# EAGLE design mkrd-001 (EAGLE 9.6.2)
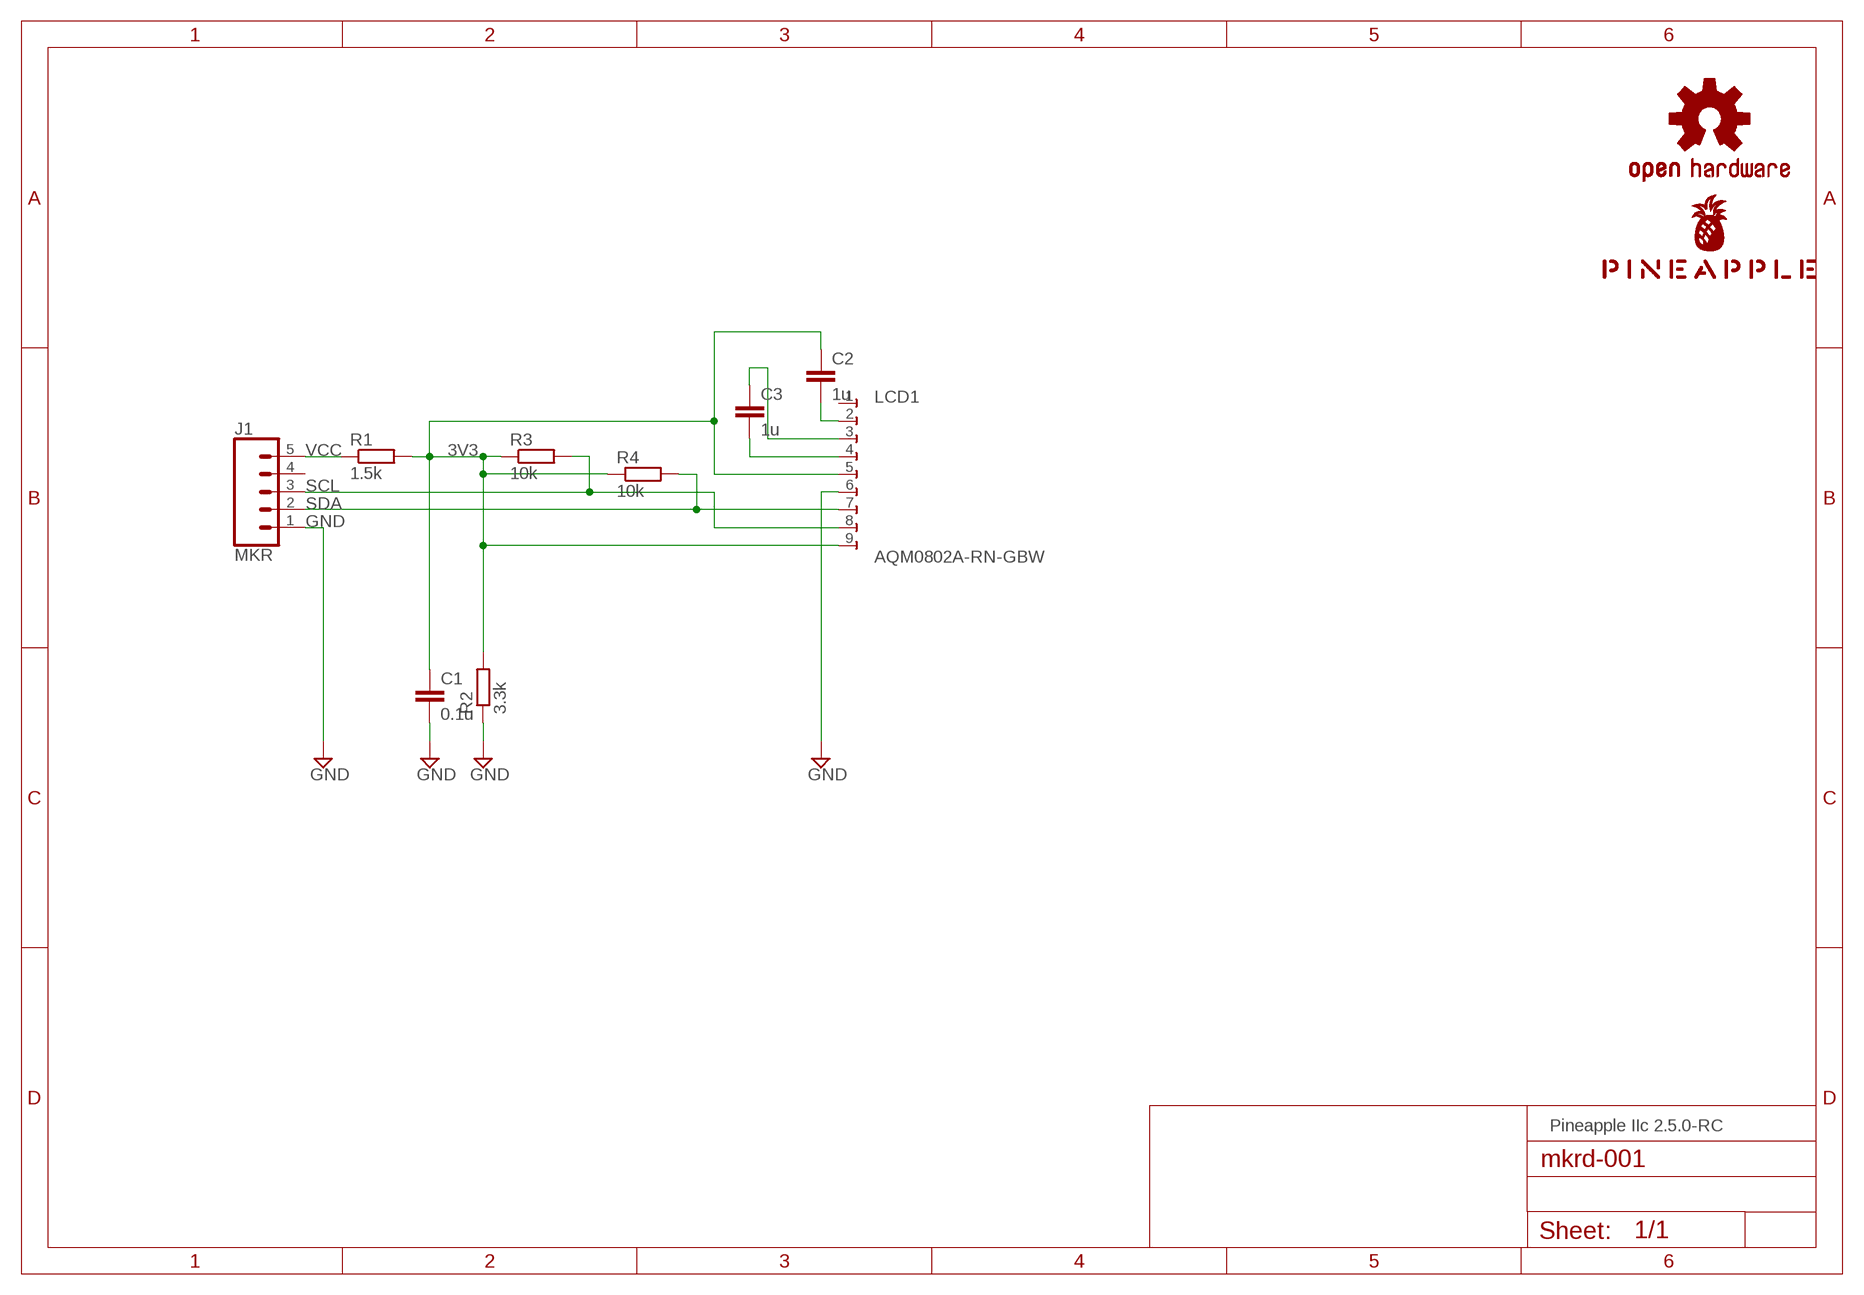
[diagram p0: schematic, sheet 1]

## Parts
C1  0.1u  C-EU025-024X044  [C025-024X044]
C2  1u  C-EU025-025X050  [C025-025X050]
C3  1u  C-EU025-025X050  [C025-025X050]
J1  MKR  CONN_05JST  [JST-5-PTH]
LCD1  AQM0802A-RN-GBW  [AQM0802A-RN-GBW-FOOTPRINT]
LOGO1  OSHW-LOGOS-COPPER  [OSHW-LOGO-S_COPPER]
R1  1.5k  R-EU_0204/5  [0204/5]
R2  3.3k  R-EU_0204/5  [0204/5]
R3  10k  R-EU_0204/5  [0204/5]
R4  10k  R-EU_0204/5  [0204/5]
U$1  PINEAPPLE450_SILK  [PINEAPPLE450_SILK]

## Nets
3V3: C1.1 C2.1 LCD1.5 LCD1.9 R1.2 R2.2 R3.1 R4.1
CAP1N: C3.1 LCD1.3
CAP1P: C3.2 LCD1.4
GND: C1.2 J1.1 LCD1.6 R2.1
LCDVOUT: C2.2 LCD1.2
SCL: J1.3 LCD1.8 R3.2
SDA: J1.2 LCD1.7 R4.2
VCC: J1.5 R1.1
Unconnected: J1.4 LCD1.1

## Notes on the sheet
- Pineapple IIc 2.5.0-RC

## Library data of the parts
C1-C3 = rcl:C-EU: CAPACITOR, European symbol; SPICEPREFIX: C
J1 = SparkFun-Connectors:CONN_05: Multi connection point. Often used as Generic Header-pin footprint for 0.1 inch spaced/style header connections On any of the 0.1 inch spaced packages, you can populate with these: Break Away Headers - Straight <https://www.sparkfun.com/products/116> (PRT-00116) Break Away Male Headers - Right Angle <https://www.sparkfun.com/products/553> (PRT-00553) Female Headers <https://www.sparkfun.com/products/115> (PRT-00115) Break Away Headers - Machine Pin <https://www.sparkfun.com/products/117> (PRT-00117) Break Away Female Headers - Swiss Machine Pin <https://www.sparkfun.com/products/743> (PRT-00743) For SCREWTERMINALS and SPRING TERMINALS visit here: Screw Terimnals on SparkFun.com <https://www.sparkfun.com/search/results?term=Screw+Terminals> (5mm/3.5mm/2.54mm spacing) This device is also useful as a general connection point to wire up your design to another part of your project. Our various solder wires solder well into these plated through hole pads. Hook-Up Wire - Assortment (Stranded, 22 AWG) <https://www.sparkfun.com/products/11375> (PRT-11375) Hook-Up Wire - Assortment (Solid Core, 22 AWG) <https://www.sparkfun.com/products/11367> (PRT-11367) View the entire wire category on our website here <https://www.sparkfun.com/categories/141> Special notes: Molex polarized connector foot print use with SKU : PRT-08231 with associated crimp pins and housings. 1MM SMD Version SKU: PRT-10208; SF_ID: PRT-09917
LCD1 = AQM0802A-RN-GBW:AQM0802A-RN-GBW: AQM0802A-RN-GBW LCD
LOGO1 = SparkFun-Aesthetics:OSHW-LOGO: Open-Source Hardware (OSHW) Logo This logo indicates the piece of hardware it is found on incorporates a OSHW license and/or adheres to the definition of open source hardware found here: http://freedomdefined.org/OSHW
R1-R4 = rcl:R-EU_: RESISTOR, European symbol; SPICEPREFIX: R
U$1 = pineapple:PINEAPPLE450_SILK

## Net classes
0 default: width 0.152 mm, drill 0.152 mm, clearance 0.152 mm
1 ground: width 0.305 mm, drill 0.152 mm, clearance 0.152 mm
2 power1: width 0.508 mm, drill 0.152 mm, clearance 0.152 mm
3 power2: width 0.61 mm, drill 0.152 mm, clearance 0.152 mm
4 analog: width 0.305 mm, drill 0.152 mm, clearance 0.152 mm
5 external: width 0.152 mm, drill 0.152 mm, clearance 0.152 mm

## Board
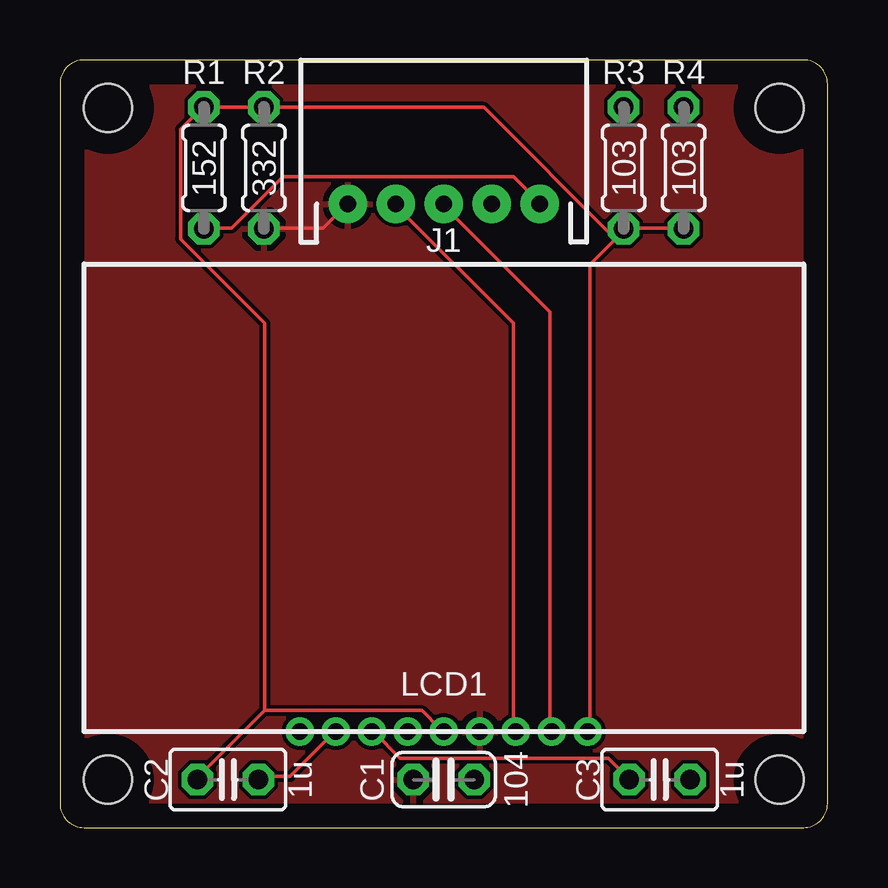
[diagram p1: board, top side]
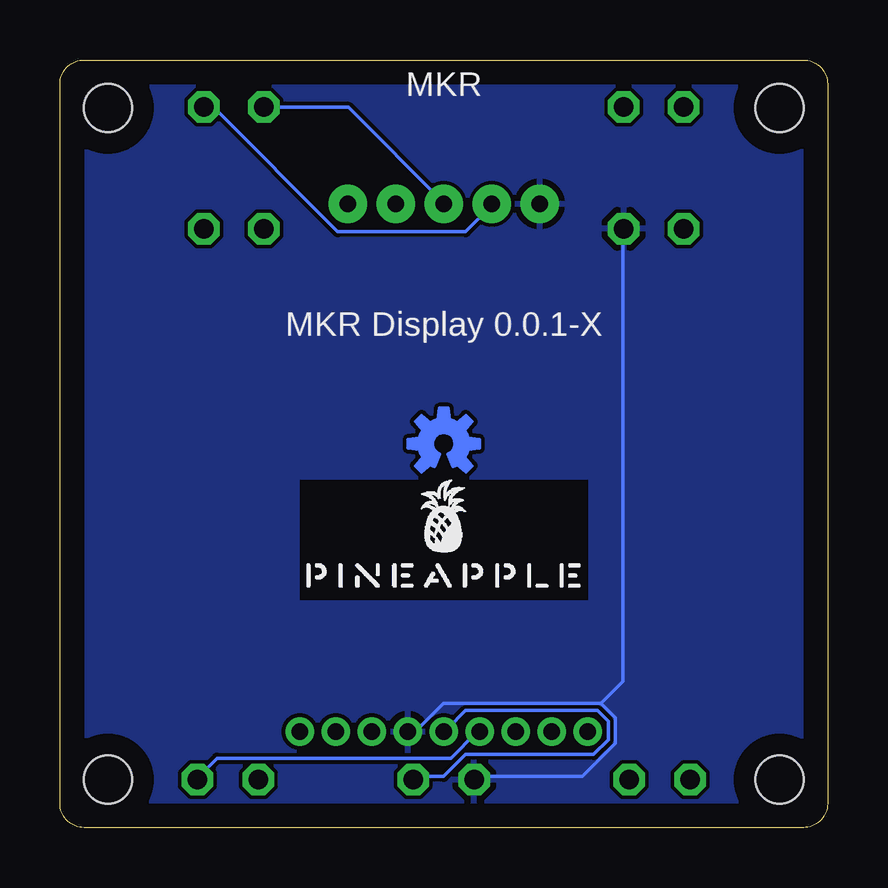
[diagram p2: board, bottom side, seen from below]

Size 32 x 32 mm. Coordinates in mm from the lower left corner, seen from the top.
Outline: 0,31 0,1 arc90 1,0 31,0 arc90 32,1 32,31 arc90 31,32 1,32 arc90 0,31
Copper layers (1*16): Top 0.035mm / dielectric 1.5mm / Bottom 0.035mm
Design rules "SeeedStudio_2layer_DRU_no_angle_20140221": minimum track width 6mil, minimum drill 12mil, track to track 6mil, track to pad 6mil, pad to pad 6mil, via to via 6mil, smd to smd 0mil, copper to edge 10mil, drill to drill 10mil, minimum pad ring 10mil, minimum via ring 6mil, stop-mask expansion 2mil, vias tented up to drill 100mil, thermal gap 10mil
Holes 2 mm at 2,2 30,2 30,30 2,30
tRestrict: area 0.2,0.2 to 3.8,3.8; area 0,0 to 1,32; area 0,31 to 32,32; area 31,0 to 32,32; area 0,0 to 32,1; area 0.2,28.2 to 3.8,31.8; area 28.2,28.2 to 31.8,31.8; area 28.2,0.2 to 31.8,3.8
bRestrict: area 0,0 to 32,1; area 31,0 to 32,32; area 0,31 to 32,32; area 0,0 to 1,32; area 28.2,0.2 to 31.8,3.8; area 0.2,28.2 to 3.8,31.8; area 0.2,0.2 to 3.8,3.8; area 28.2,28.2 to 31.8,31.8; area 10,9.5 to 22,14.5

### Footprints (pad centres in the part's own frame; a part is rotated, then mirrored left to right if it is on the bottom)
C025-024X044 = drill 0.813 octagon: 1 -1.27,0; 2 1.27,0
C025-025X050 = drill 0.813 octagon: 1 -1.27,0; 2 1.27,0
JST-5-PTH = drill 0.7 pad 1.6: 1 -4,0; 2 -2,0; 3 0,0; 4 2,0; 5 4,0
AQM0802A-RN-GBW-FOOTPRINT = drill 0.7 pad 1: 1 -6,0; 2 -4.5,0; 3 -3,0; 4 -1.5,0; 5 0,0; 6 1.5,0; 7 3,0; 8 4.5,0; 9 6,0
0204/5 = drill 0.813 octagon: 1 -2.54,0; 2 2.54,0

### Placement (x,y rotation side)
C1  16,2 180 top
C2  7,2 0 top
C3  25,2 0 top
J1  16,26 0 top
LCD1  16,4 0 top
LOGO1  16,16 0 bottom
R1  6,27.5 90 top
R2  8.5,27.5 90 top
R3  23.5,27.5 90 top
R4  26,27.5 90 top
U$1  16,10 0 bottom

### Tracks (layer width: path | path; a pad name or v marks a point on that pad's centre or on a via)
3V3
  Top 0.152: 8.53,4.88 15.09,4.88 15.85,4.12 LCD1.5 | 8.53,4.88 5.79,2.13 C2.1 | 23.16,24.54 23.47,24.84 R3.1 | 23.16,24.54 22.1,23.47 22.1,4.12 LCD1.9 | R4.1 25.91,24.99 23.62,24.99 R3.1 | 23.16,24.54 17.68,30.02 8.53,30.02 R2.2 8.38,30.02 6.1,30.02 R1.2 5.94,30.02 5.03,29.11 5.03,24.54 8.53,21.03 8.53,4.88 | 23.16,24.54 R3.1
  Bottom 0.152: C1.1 17.22,2.13 16,2.13 15.09,3.05 9.75,3.05 9.14,3.66 9.14,4.42 9.6,4.88 15.09,4.88 15.85,4.12 LCD1.5
CAP1N
  Top 0.152: LCD1.3 13.11,3.96 14.17,2.9 22.86,2.9 23.62,2.13 C3.1
CAP1P
  Bottom 0.152: LCD1.4 14.63,3.96 15.7,2.9 25.45,2.9 26.21,2.13 C3.2
GND
  Top 0.152: R2.1 8.53,24.99 10.97,24.99 11.89,25.91 J1.1
  Bottom 0.152: 9.45,5.18 16,5.18 17.07,4.12 17.37,4.12 LCD1.6 | 9.45,5.18 8.84,4.57 8.84,3.5 10.21,2.13 14.63,2.13 C1.2 | 9.45,5.18 8.53,6.1 8.53,24.84 R2.1
  pour Top: -1,-1 33,-1 33,33 -1,33
  pour Bottom: -2,-2 34,-2 34,34 -2,34
LCDVOUT
  Top 0.152: LCD1.2 11.43,3.96 9.6,2.13 8.38,2.13 C2.2
SCL
  Top 0.152: LCD1.8 20.42,4.12 20.42,21.49 16,25.91 J1.3
  Bottom 0.152: R3.2 23.47,30.02 19.96,30.02 16,26.06 J1.3
SDA
  Top 0.152: LCD1.7 18.9,4.12 18.9,21.03 14.02,25.91 J1.2
  Bottom 0.152: R4.2 25.91,30.02 25.6,30.02 20.42,24.84 15.09,24.84 14.02,25.91 J1.2
VCC
  Top 0.152: R1.1 6.1,24.99 7.16,24.99 9.3,27.13 18.9,27.13 19.96,26.06 J1.5

### Text on the board
tNames: 152 | 332 | 103 | 103 | 1u | 104 | 1u
bNames: MKR | MKR Display 0.0.1-X